# Altium schematic sheet Condor2_Plugs_REV_C.SchDoc
size A4; DrawnBy: Philip Rowse
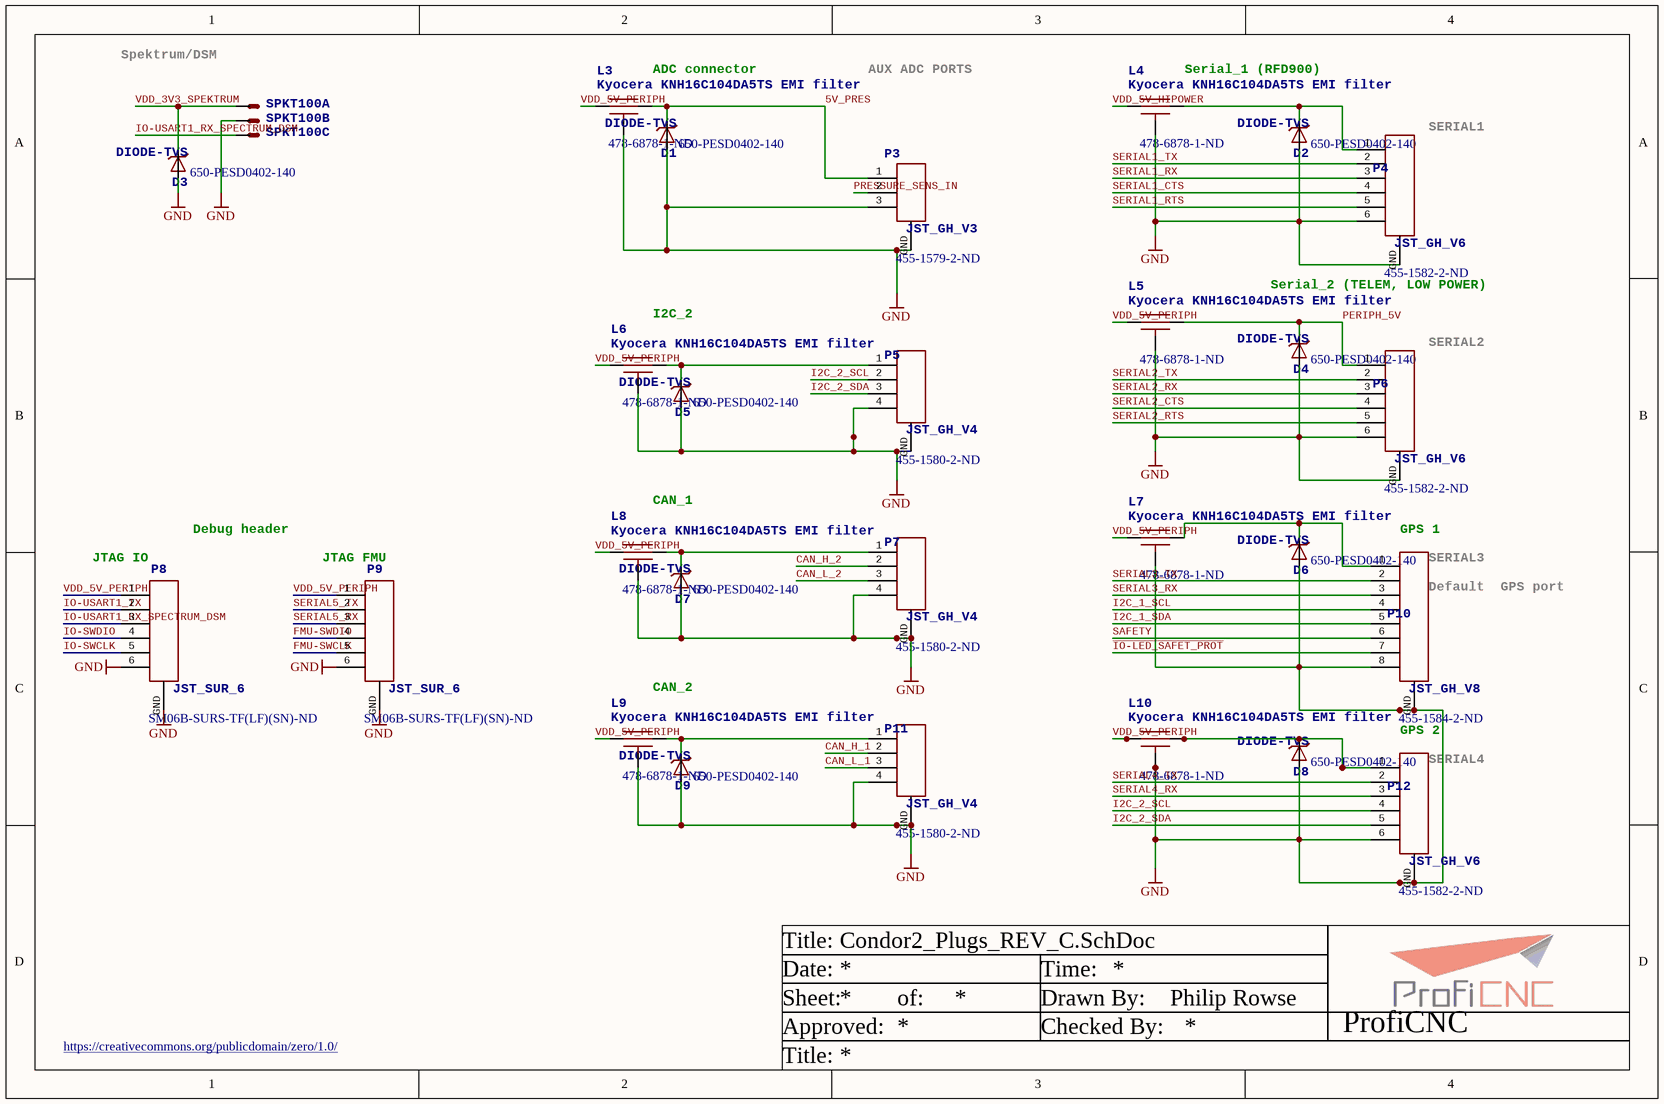
[diagram p0: Condor2_Plugs_REV_C.SchDoc]

## Parts
D1  DIODE-TVS  Supplier Part Number 1: 650-PESD0402-140  [0402-TVS]
D2  DIODE-TVS  Supplier Part Number 1: 650-PESD0402-140  [0402-TVS]
D3  DIODE-TVS  Supplier Part Number 1: 650-PESD0402-140  [0402-TVS]
D4  DIODE-TVS  Supplier Part Number 1: 650-PESD0402-140  [0402-TVS]
D5  DIODE-TVS  Supplier Part Number 1: 650-PESD0402-140  [0402-TVS]
D6  DIODE-TVS  Supplier Part Number 1: 650-PESD0402-140  [0402-TVS]
D7  DIODE-TVS  Supplier Part Number 1: 650-PESD0402-140  [0402-TVS]
D8  DIODE-TVS  Supplier Part Number 1: 650-PESD0402-140  [0402-TVS]
D9  DIODE-TVS  Supplier Part Number 1: 650-PESD0402-140  [0402-TVS]
L3  Kyocera KNH16C104DA5TS EMI filter  Supplier Part Number 1: 478-6878-1-ND  [KYOCERA-KNH16-DA]
L4  Kyocera KNH16C104DA5TS EMI filter  Supplier Part Number 1: 478-6878-1-ND  [KYOCERA-KNH16-DA]
L5  Kyocera KNH16C104DA5TS EMI filter  Supplier Part Number 1: 478-6878-1-ND  [KYOCERA-KNH16-DA]
L6  Kyocera KNH16C104DA5TS EMI filter  Supplier Part Number 1: 478-6878-1-ND  [KYOCERA-KNH16-DA]
L7  Kyocera KNH16C104DA5TS EMI filter  Supplier Part Number 1: 478-6878-1-ND  [KYOCERA-KNH16-DA]
L8  Kyocera KNH16C104DA5TS EMI filter  Supplier Part Number 1: 478-6878-1-ND  [KYOCERA-KNH16-DA]
L9  Kyocera KNH16C104DA5TS EMI filter  Supplier Part Number 1: 478-6878-1-ND  [KYOCERA-KNH16-DA]
L10  Kyocera KNH16C104DA5TS EMI filter  Supplier Part Number 1: 478-6878-1-ND  [KYOCERA-KNH16-DA]
P3  JST_GH_V3  Supplier Part Number 1: 455-1579-2-ND  [JST_GH_V3]
P4  JST_GH_V6  Supplier Part Number 1: 455-1582-2-ND  [JST_GH_V6]
P5  JST_GH_V4  Supplier Part Number 1: 455-1580-2-ND  [JST_GH_V4]
P6  JST_GH_V6  Supplier Part Number 1: 455-1582-2-ND  [JST_GH_V6]
P7  JST_GH_V4  Supplier Part Number 1: 455-1580-2-ND  [JST_GH_V4]
P8  JST_SUR_6  Supplier Part Number 1: SM06B-SURS-TF(LF)(SN)-ND  [JST_SUR_H6]
P9  JST_SUR_6  Supplier Part Number 1: SM06B-SURS-TF(LF)(SN)-ND  [JST_SUR_H6]
P10  JST_GH_V8  Supplier Part Number 1: 455-1584-2-ND  [JST_GH_V8]
P11  JST_GH_V4  Supplier Part Number 1: 455-1580-2-ND  [JST_GH_V4]
P12  JST_GH_V6  Supplier Part Number 1: 455-1582-2-ND  [JST_GH_V6]
SPKT100  CONN_SPEKTRUM_RX-TH  [B3B-ZR]  (value not drawn)  (parts A,B,C of 3)

## Nets
GND: D1.A D2.A D3.A D4.A D5.A D6.A D7.A D8.A D9.A L3.GND L4.GND L5.GND L6.GND L7.GND L8.GND L9.GND L10.GND P3.3 P3.GND P4.6 P4.GND P5.4 P5.GND P6.6 P6.GND P7.4 P7.GND P8.6 P8.GND P9.6 P9.GND P10.8 P10.GND P11.4 P11.GND P12.6 P12.GND SPKT100.2(S)
5V_PRES: D1.C L3.P$2 P3.1
CAN_H_1: P11.2
CAN_H_2: P7.2
CAN_L_1: P11.3
CAN_L_2: P7.3
FMU-SWCLK: P9.5
FMU-SWDIO: P9.4
I2C_1_SCL: P10.4
I2C_1_SDA: P10.5
I2C_2_SCL: P5.2 P12.4
I2C_2_SDA: P5.3 P12.5
~{IO-LED_SAFET_PROT}: P10.7
IO-SWCLK: P8.5
IO-SWDIO: P8.4
IO-USART1_RX_SPECTRUM_DSM: P8.3 SPKT100.1(S)
IO-USART1_TX: P8.2
PERIPH_5V: D4.C L5.P$2 P6.1
PRESSURE_SENS_IN: P3.2
SAFETY: P10.6
SERIAL1_CTS: P4.4
SERIAL1_RTS: P4.5
SERIAL1_RX: P4.3
SERIAL1_TX: P4.2
SERIAL2_CTS: P6.4
SERIAL2_RTS: P6.5
SERIAL2_RX: P6.3
SERIAL2_TX: P6.2
SERIAL3_RX: P10.3
SERIAL3_TX: P10.2
SERIAL4_RX: P12.3
SERIAL4_TX: P12.2
SERIAL5_RX: P9.3
SERIAL5_TX: P9.2
VDD_3V3_SPEKTRUM: D3.C SPKT100.3(S)
VDD_5V_HIPOWER: L4.P$1
VDD_5V_PERIPH: L3.P$1 L5.P$1 L6.P$1 L7.P$1 L8.P$1 L9.P$1 L10.P$1 P8.1 P9.1
NetD2_C: D2.C L4.P$2 P4.1
NetD5_C: D5.C L6.P$2 P5.1
NetD6_C: D6.C L7.P$2 P10.1
NetD7_C: D7.C L8.P$2 P7.1
NetD8_C: D8.C L10.P$2 P12.1
NetD9_C: D9.C L9.P$2 P11.1

## Notes on the sheet
- Spektrum/DSM
- (near L3) ADC connector
- AUX ADC PORTS
- (near L4) Serial_1 (RFD900)
- (near P4) SERIAL1
- (near L6) I2C_2
- Serial_2 (TELEM, LOW POWER)
- (near P6) SERIAL2
- Debug header
- (near L8) CAN_1
- (near P10) GPS 1
- (near P8) JTAG IO
- (near P9) JTAG FMU
- (near P10) SERIAL3
- (near P10) Default
  GPS port
- (near L9) CAN_2
- GPS 2
- (near P12) SERIAL4
- Title:
- Date:
- Time:
- https://creativecommons.org/publicdomain/zero/1.0/
- Sheet:
- Approved:
- of:
- Drawn By:
- Checked By:
- ProfiCNC

## Library data of the parts
D1-D9 = DIODE-TVS: Diode, TVS, 14VWM, 40VC, 0402, SMD; Supplier 1: Mouser
L3-L10 = KNH16C104DA5TS: Capacitor, Filter, 0.1uF, 25V, 2A, 0603, SMD; Supplier 1: Digi-Key
P3 = JST_GH_V3: BM03B-GHS-TBT; Supplier 1: Digi-Key
P4 P6 P12 = JST_GH_V6: BM06B-GHS-TBT; Supplier 1: Digi-Key
P5 P7 P11 = JST_GH_V4: BM04B-GHS-TBT; Supplier 1: Digi-Key
P8 P9 = JST_SUR_6: Connector, Header, 6Pos, .8mm IDC, R/A, SMD, Tin; Supplier 1: Digi-Key
P10 = JST_GH_V8: BM08B-GHS-TBT; Supplier 1: Digi-Key
SPKT100 = CONN_SPEKTRUM_RX-TH: Spektrum RX connector; JST ZH series S3B-ZR-SM4A-TF; PARTNO: B3B-ZR(LF)(SN)